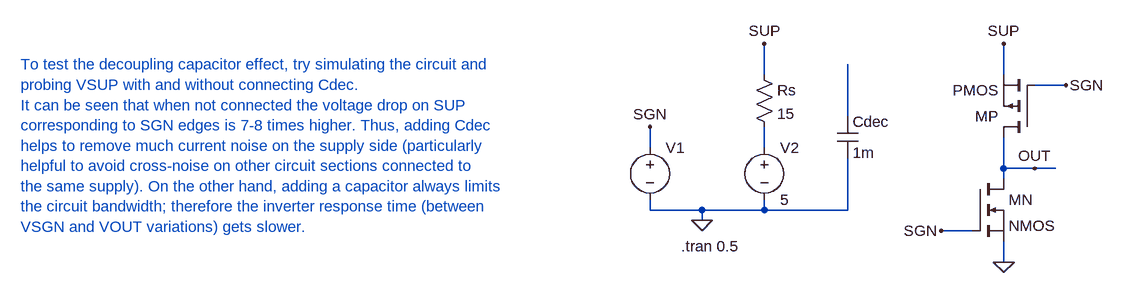
[diagram p0: schematic __Decoupling_Capacitor.asc]
__Decoupling_Capacitor.asc, the LTspice schematic file:
Version 4
SHEET 1 880 680
WIRE -1456 0 -1456 -48
WIRE -1088 0 -1088 -48
WIRE -992 16 -1040 16
WIRE -1328 64 -1328 -16
WIRE -1632 112 -1632 80
WIRE -1456 112 -1456 80
WIRE -1088 144 -1088 96
WIRE -1040 144 -1088 144
WIRE -1008 144 -1040 144
WIRE -1088 160 -1088 144
WIRE -1632 208 -1632 192
WIRE -1552 208 -1632 208
WIRE -1456 208 -1456 192
WIRE -1456 208 -1552 208
WIRE -1328 208 -1328 128
WIRE -1328 208 -1456 208
WIRE -1552 224 -1552 208
WIRE -1136 240 -1184 240
WIRE -1088 288 -1088 256
FLAG -1088 288 0
FLAG -1552 224 0
FLAG -1456 -48 SUP
FLAG -1088 -48 SUP
FLAG -1632 80 SGN
FLAG -1184 240 SGN
FLAG -992 16 SGN
FLAG -1040 144 OUT
SYMBOL voltage -1632 96 R0
WINDOW 3 24 96 Invisible 2
WINDOW 123 0 0 Left 0
WINDOW 39 0 0 Left 0
SYMATTR Value PULSE(5 0 0 0 0 0.05 0.1)
SYMATTR InstName V1
SYMBOL voltage -1456 96 R0
WINDOW 123 0 0 Left 0
WINDOW 39 0 0 Left 0
SYMATTR InstName V2
SYMATTR Value 5
SYMBOL res -1472 -16 R0
SYMATTR InstName Rs
SYMATTR Value 15
SYMBOL pmos -1040 96 R180
SYMATTR InstName MP
SYMBOL nmos -1136 160 R0
SYMATTR InstName MN
SYMBOL cap -1344 64 R0
SYMATTR InstName Cdec
SYMATTR Value 1m
TEXT -1584 264 Left 2 !.tran 0.5
TEXT -2600 -16 Left 2 ;To test the decoupling capacitor effect, try simulating the circuit and\nprobing VSUP with and without connecting Cdec.\nIt can be seen that when not connected the voltage drop on SUP\ncorresponding to SGN edges is 7-8 times higher. Thus, adding Cdec\nhelps to remove much current noise on the supply side (particularly\nhelpful to avoid cross-noise on other circuit sections connected to\nthe same supply). On the other hand, adding a capacitor always limits\nthe circuit bandwidth; therefore the inverter response time (between\nVSGN and VOUT variations) gets slower.

The netlist it stands for:
* __Decoupling_Capacitor.asc
V1 SGN 0 PULSE(5 0 0 0 0 0.05 0.1)
V2 N002 0 5
Rs SUP N002 15
MP OUT SGN SUP SUP PMOS
MN OUT SGN 0 0 NMOS
Cdec N001 0 1m
.model NMOS NMOS
.model PMOS PMOS
.lib standard.mos
.tran 0.5
* To test the decoupling capacitor effect, try simulating the circuit and
* probing VSUP with and without connecting Cdec.
* It can be seen that when not connected the voltage drop on SUP
* corresponding to SGN edges is 7-8 times higher. Thus, adding Cdec
* helps to remove much current noise on the supply side (particularly
* helpful to avoid cross-noise on other circuit sections connected to
* the same supply). On the other hand, adding a capacitor always limits
* the circuit bandwidth; therefore the inverter response time (between
* VSGN and VOUT variations) gets slower.
.backanno
.end